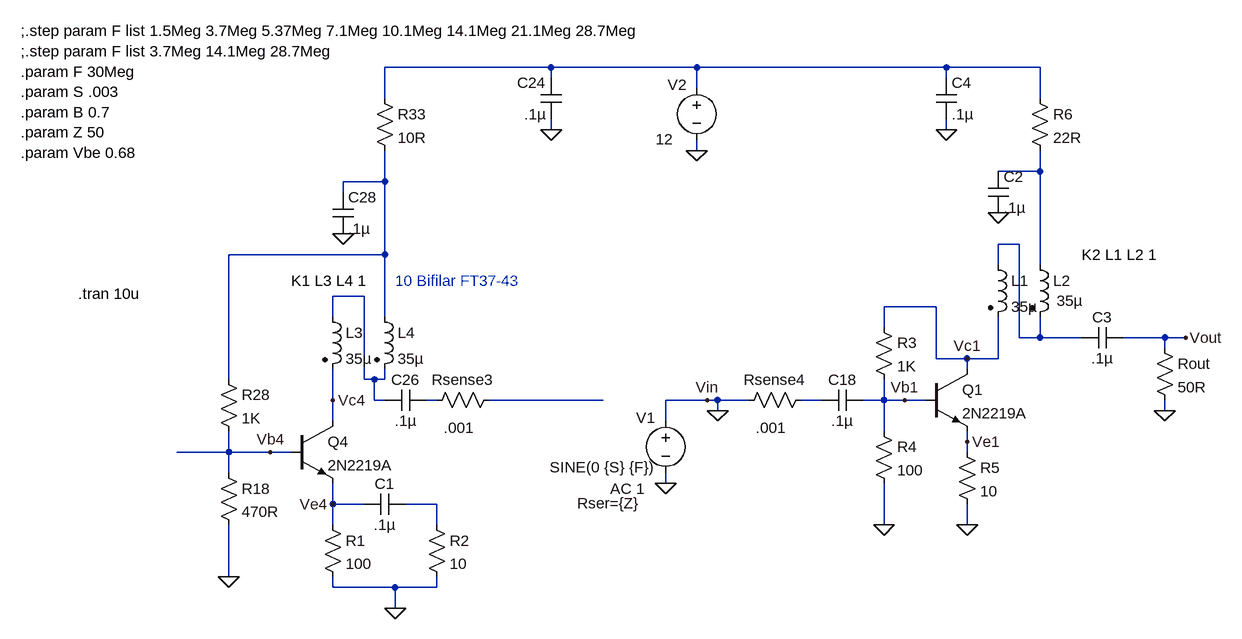
[diagram p0: schematic 2N3904 Bias testing.asc]
2N3904 Bias testing.asc, the LTspice schematic file:
Version 4
SHEET 1 3748 1540
WIRE -976 -592 -1232 -592
WIRE -752 -592 -976 -592
WIRE -368 -592 -752 -592
WIRE -224 -592 -368 -592
WIRE -976 -576 -976 -592
WIRE -368 -576 -368 -592
WIRE -752 -560 -752 -592
WIRE -1232 -544 -1232 -592
WIRE -224 -544 -224 -592
WIRE -976 -496 -976 -512
WIRE -368 -496 -368 -512
WIRE -752 -464 -752 -480
WIRE -224 -432 -224 -464
WIRE -224 -432 -288 -432
WIRE -1232 -416 -1232 -464
WIRE -1232 -416 -1296 -416
WIRE -1296 -400 -1296 -416
WIRE -256 -320 -288 -320
WIRE -1232 -304 -1232 -416
WIRE -1232 -304 -1472 -304
WIRE -288 -288 -288 -320
WIRE -224 -288 -224 -432
WIRE -1264 -240 -1312 -240
WIRE -384 -224 -464 -224
WIRE -1312 -208 -1312 -240
WIRE -1232 -208 -1232 -304
WIRE -464 -192 -464 -224
WIRE -256 -176 -256 -320
WIRE -224 -176 -224 -208
WIRE -224 -176 -256 -176
WIRE -160 -176 -224 -176
WIRE -32 -176 -96 -176
WIRE 0 -176 -32 -176
WIRE -32 -160 -32 -176
WIRE -384 -144 -384 -224
WIRE -336 -144 -384 -144
WIRE -288 -144 -288 -208
WIRE -288 -144 -336 -144
WIRE -336 -128 -336 -144
WIRE -1472 -112 -1472 -304
WIRE -1264 -112 -1264 -240
WIRE -1248 -112 -1264 -112
WIRE -1232 -112 -1232 -128
WIRE -1232 -112 -1248 -112
WIRE -1312 -80 -1312 -128
WIRE -1248 -80 -1248 -112
WIRE -1232 -80 -1248 -80
WIRE -1152 -80 -1168 -80
WIRE -896 -80 -1072 -80
WIRE -736 -80 -800 -80
WIRE -720 -80 -736 -80
WIRE -672 -80 -720 -80
WIRE -560 -80 -592 -80
WIRE -464 -80 -464 -112
WIRE -464 -80 -496 -80
WIRE -432 -80 -464 -80
WIRE -400 -80 -432 -80
WIRE -720 -64 -720 -80
WIRE -32 -64 -32 -80
WIRE -1312 -48 -1312 -80
WIRE -800 -48 -800 -80
WIRE -464 -32 -464 -80
WIRE -336 -16 -336 -32
WIRE -1472 0 -1472 -32
WIRE -1472 0 -1552 0
WIRE -1408 0 -1472 0
WIRE -1376 0 -1408 0
WIRE -336 0 -336 -16
WIRE -1472 32 -1472 0
WIRE -800 48 -800 32
WIRE -1312 80 -1312 48
WIRE -1264 80 -1312 80
WIRE -1152 80 -1200 80
WIRE -1312 112 -1312 80
WIRE -1152 112 -1152 80
WIRE -464 112 -464 48
WIRE -336 112 -336 80
WIRE -1472 192 -1472 112
WIRE -1312 208 -1312 192
WIRE -1216 208 -1312 208
WIRE -1152 208 -1152 192
WIRE -1152 208 -1216 208
WIRE -1216 240 -1216 208
FLAG -800 48 0
FLAG 0 -176 Vout
FLAG -32 -64 0
FLAG -736 -80 Vin
FLAG -976 -496 0
FLAG -1472 192 0
FLAG -1296 -336 0
FLAG -1408 0 Vb4
FLAG -1312 -80 Vc4
FLAG -752 -464 0
FLAG -720 -64 0
FLAG -1216 240 0
FLAG -1312 80 Ve4
FLAG -464 112 0
FLAG -336 112 0
FLAG -288 -368 0
FLAG -368 -496 0
FLAG -432 -80 Vb1
FLAG -336 -144 Vc1
FLAG -336 -16 Ve1
SYMBOL voltage -800 -64 R0
WINDOW 0 -45 11 Left 2
WINDOW 3 -178 87 Left 2
WINDOW 123 -85 120 Left 2
WINDOW 39 -136 143 Left 2
SYMATTR InstName V1
SYMATTR Value SINE(0 {S} {F})
SYMATTR Value2 AC 1
SYMATTR SpiceLine Rser={Z}
SYMBOL cap -96 -192 R90
WINDOW 0 0 32 VBottom 2
WINDOW 3 32 32 VTop 2
SYMATTR InstName C3
SYMATTR Value .1µ
SYMBOL res -48 -176 R0
SYMATTR InstName Rout
SYMATTR Value 50R
SYMBOL res -1056 -96 R90
WINDOW 0 0 56 VBottom 2
WINDOW 3 43 62 VTop 2
SYMATTR InstName Rsense3
SYMATTR Value .001
SYMBOL ind2 -1328 -224 R0
SYMATTR InstName L3
SYMATTR Value 35µ
SYMATTR Type ind
SYMBOL ind2 -1248 -224 R0
SYMATTR InstName L4
SYMATTR Value 35µ
SYMATTR Type ind
SYMBOL cap -496 -96 R90
WINDOW 0 0 32 VBottom 2
WINDOW 3 32 32 VTop 2
SYMATTR InstName C18
SYMATTR Value .1µ
SYMBOL npn -1376 -48 R0
SYMATTR InstName Q4
SYMATTR Value 2N2219A
SYMBOL res -1488 16 R0
SYMATTR InstName R18
SYMATTR Value 470R
SYMBOL res -1488 -128 R0
SYMATTR InstName R28
SYMATTR Value 1K
SYMBOL cap -960 -512 R180
WINDOW 0 24 56 Left 2
WINDOW 3 24 8 Left 2
SYMATTR InstName C24
SYMATTR Value .1µ
SYMBOL cap -1232 -64 R270
WINDOW 0 32 32 VTop 2
WINDOW 3 0 32 VBottom 2
SYMATTR InstName C26
SYMATTR Value .1µ
SYMBOL res -1248 -560 R0
SYMATTR InstName R33
SYMATTR Value 10R
SYMBOL cap -1312 -400 R0
SYMATTR InstName C28
SYMATTR Value .1µ
SYMBOL res -576 -96 R90
WINDOW 0 0 56 VBottom 2
WINDOW 3 43 62 VTop 2
SYMATTR InstName Rsense4
SYMATTR Value .001
SYMBOL voltage -752 -576 R0
WINDOW 0 -45 11 Left 2
WINDOW 3 -63 95 Left 2
WINDOW 123 -97 119 Left 2
WINDOW 39 -214 151 Left 2
SYMATTR InstName V2
SYMATTR Value 12
SYMBOL res -1328 96 R0
SYMATTR InstName R1
SYMATTR Value 100
SYMBOL res -1168 96 R0
SYMATTR InstName R2
SYMATTR Value 10
SYMBOL cap -1200 64 R90
WINDOW 0 0 32 VBottom 2
WINDOW 3 32 32 VTop 2
SYMATTR InstName C1
SYMATTR Value .1µ
SYMBOL npn -400 -128 R0
SYMATTR InstName Q1
SYMATTR Value 2N2219A
SYMBOL res -480 -208 R0
SYMATTR InstName R3
SYMATTR Value 1K
SYMBOL res -480 -48 R0
SYMATTR InstName R4
SYMATTR Value 100
SYMBOL res -352 -16 R0
SYMATTR InstName R5
SYMATTR Value 10
SYMBOL res -240 -560 R0
SYMATTR InstName R6
SYMATTR Value 22R
SYMBOL cap -304 -432 R0
SYMATTR InstName C2
SYMATTR Value .1µ
SYMBOL ind2 -304 -304 R0
SYMATTR InstName L1
SYMATTR Value 35µ
SYMATTR Type ind
SYMBOL ind2 -240 -304 R0
WINDOW 3 42 71 Left 2
SYMATTR Value 35µ
SYMATTR InstName L2
SYMATTR Type ind
SYMBOL cap -384 -576 R0
SYMATTR InstName C4
SYMATTR Value .1µ
TEXT -1792 -648 Left 2 !;.step param F list 1.5Meg 3.7Meg 5.37Meg 7.1Meg 10.1Meg 14.1Meg 21.1Meg 28.7Meg\n;.step param F list 3.7Meg 14.1Meg 28.7Meg\n.param F 30Meg\n.param S .003\n.param B 0.7\n.param Z 50\n.param Vbe 0.68
TEXT -1376 -264 Left 2 !K1 L3 L4 1
TEXT -1216 -264 Left 2 ;10 Bifilar FT37-43
TEXT -1704 -244 Left 2 !.tran 10u
TEXT -160 -304 Left 2 !K2 L1 L2 1

The netlist it stands for:
* 2N3904 Bias testing.asc
V1 0 0 SINE(0 {S} {F}) AC 1 Rser={Z}
C3 Vout N004 .1µ
Rout Vout 0 50R
Rsense3 N007 N006 .001
L3 N005 Vc4 35µ
L4 N003 N005 35µ
C18 Vb1 N008 .1µ
Q4 Vc4 Vb4 Ve4 0 2N2219A
R18 Vb4 0 470R
R28 N003 Vb4 1K
C24 0 N001 .1µ
C26 N005 N006 .1µ
R33 N001 N003 10R
C28 N003 0 .1µ
Rsense4 N008 0 .001
V2 N001 0 12
R1 Ve4 0 100
R2 N009 0 10
C1 N009 Ve4 .1µ
Q1 Vc1 Vb1 Ve1 0 2N2219A
R3 Vc1 Vb1 1K
R4 Vb1 0 100
R5 Ve1 0 10
R6 N001 N002 22R
C2 N002 0 .1µ
L1 N004 Vc1 35µ
L2 N002 N004 35µ
C4 N001 0 .1µ
.model NPN NPN
.model PNP PNP
.lib standard.bjt
;.step param F list 1.5Meg 3.7Meg 5.37Meg 7.1Meg 10.1Meg 14.1Meg 21.1Meg 28.7Meg
;.step param F list 3.7Meg 14.1Meg 28.7Meg
.param F 30Meg
.param S .003
.param B 0.7
.param Z 50
.param Vbe 0.68
K1 L3 L4 1
* 10 Bifilar FT37-43
.tran 10u
K2 L1 L2 1
.backanno
.end